# Altium schematic sheet (6) Controller A20_OUTPUT.SchDoc
size 355 x 304 mm; SheetNumber: 6; SheetTotal: 6
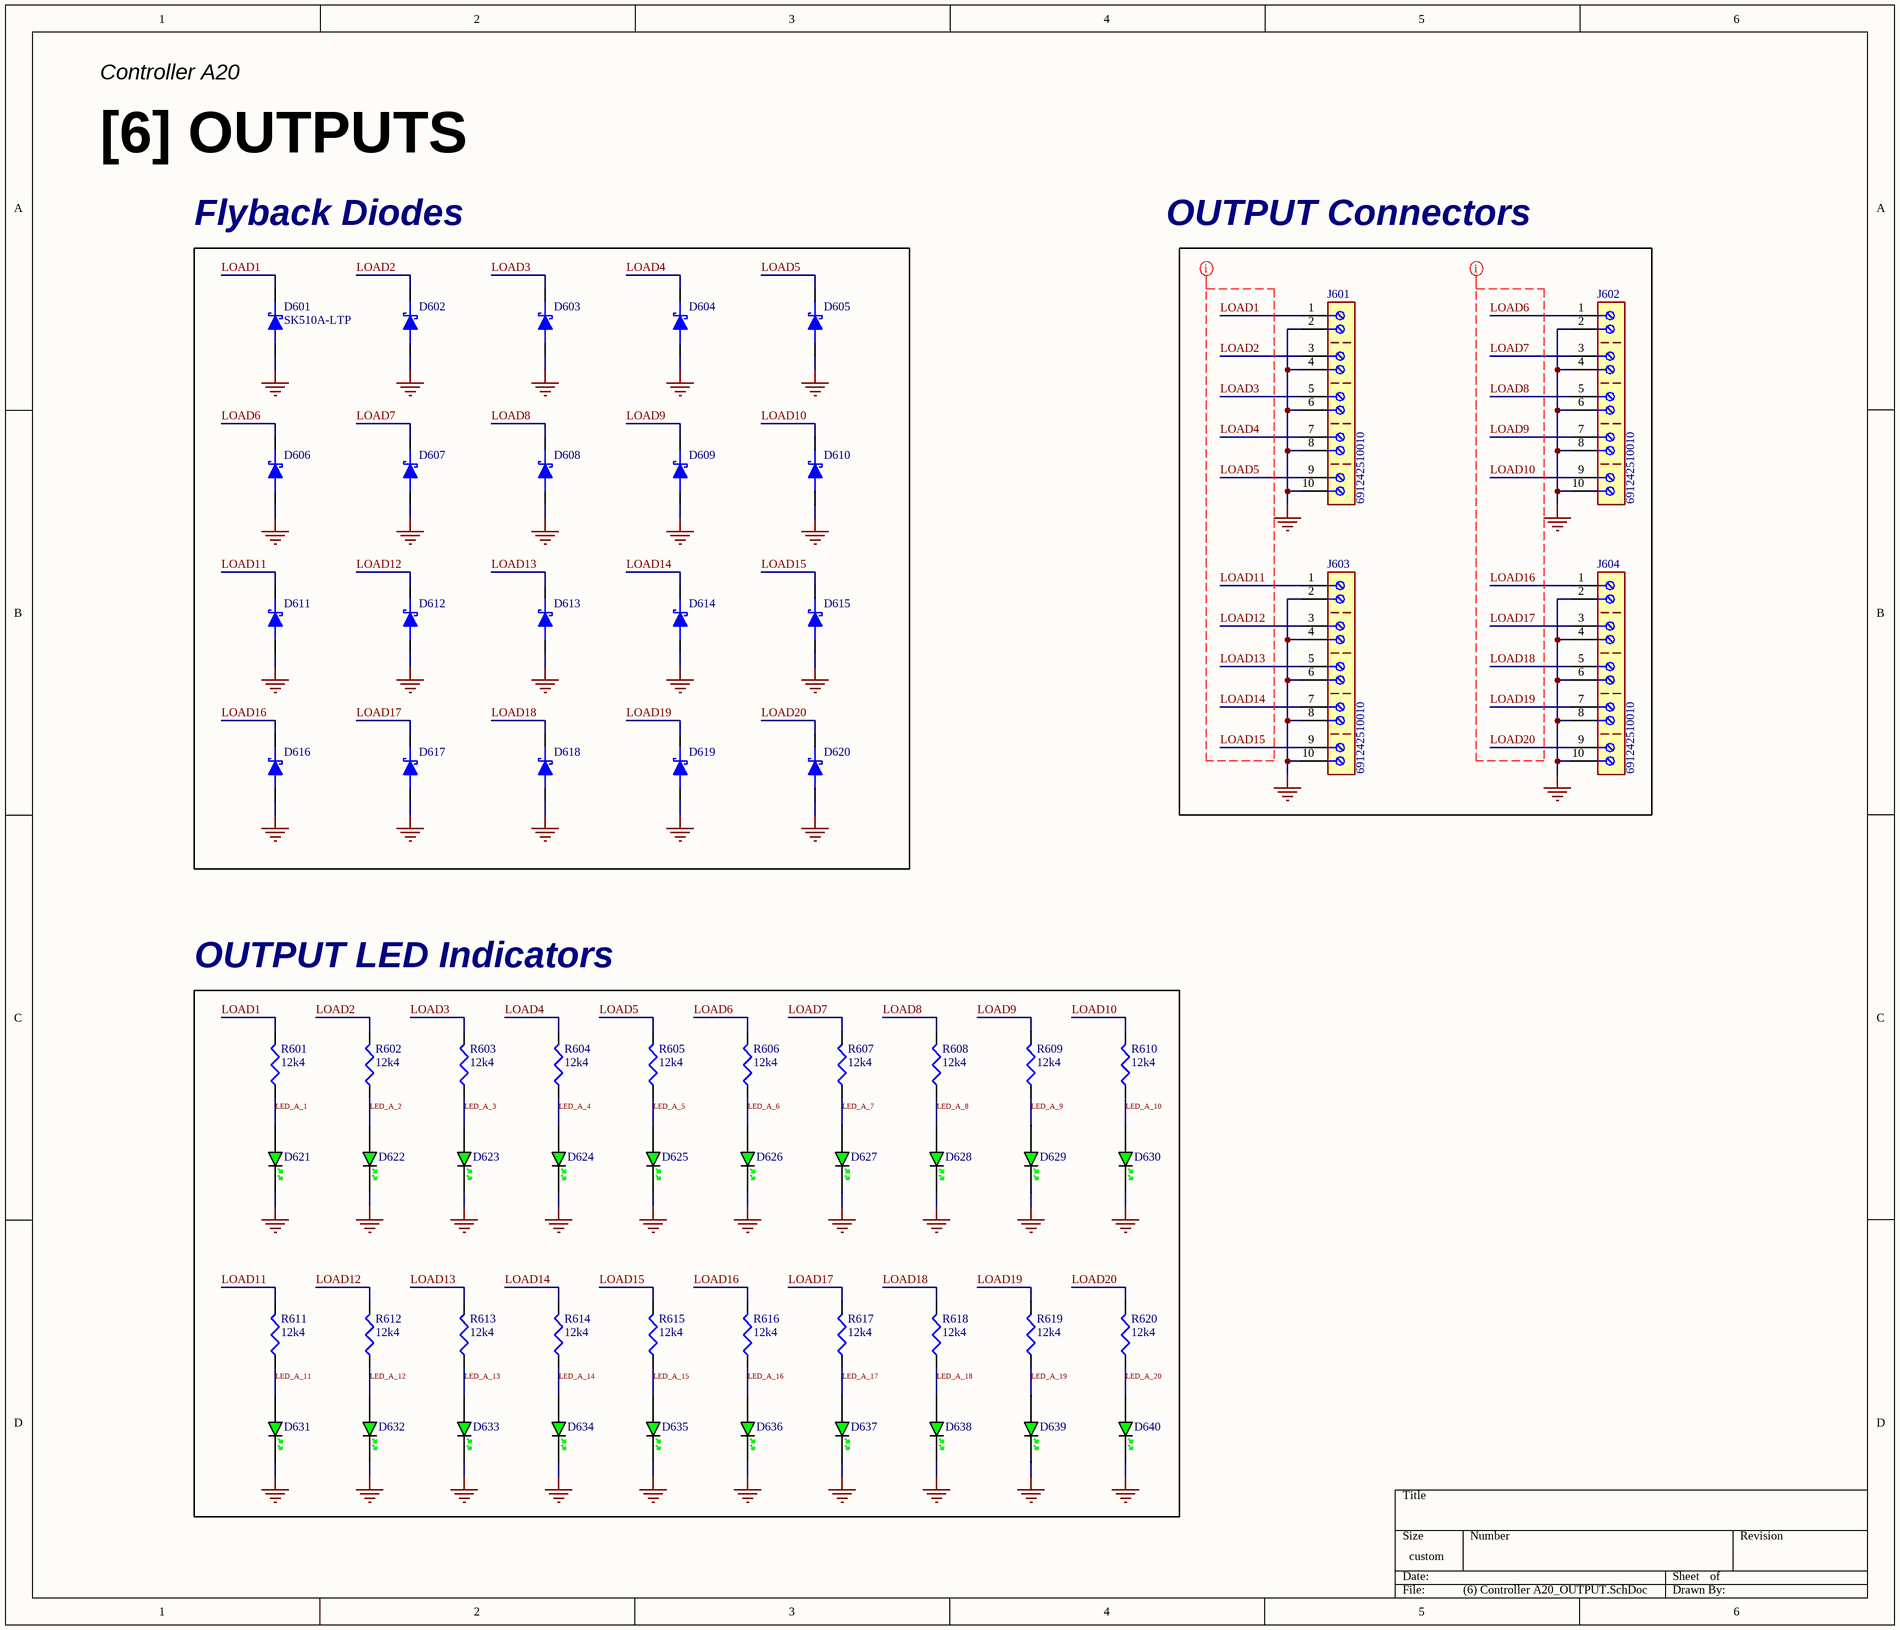
[diagram p0: (6) Controller A20_OUTPUT.SchDoc]

## Parts
D601  SK510A-LTP  [DO-214AC(SMA)]
D602  SK510A-LTP  [DO-214AC(SMA)]  (value not drawn)
D603  SK510A-LTP  [DO-214AC(SMA)]  (value not drawn)
D604  SK510A-LTP  [DO-214AC(SMA)]  (value not drawn)
D605  SK510A-LTP  [DO-214AC(SMA)]  (value not drawn)
D606  SK510A-LTP  [DO-214AC(SMA)]  (value not drawn)
D607  SK510A-LTP  [DO-214AC(SMA)]  (value not drawn)
D608  SK510A-LTP  [DO-214AC(SMA)]  (value not drawn)
D609  SK510A-LTP  [DO-214AC(SMA)]  (value not drawn)
D610  SK510A-LTP  [DO-214AC(SMA)]  (value not drawn)
D611  SK510A-LTP  [DO-214AC(SMA)]  (value not drawn)
D612  SK510A-LTP  [DO-214AC(SMA)]  (value not drawn)
D613  SK510A-LTP  [DO-214AC(SMA)]  (value not drawn)
D614  SK510A-LTP  [DO-214AC(SMA)]  (value not drawn)
D615  SK510A-LTP  [DO-214AC(SMA)]  (value not drawn)
D616  SK510A-LTP  [DO-214AC(SMA)]  (value not drawn)
D617  SK510A-LTP  [DO-214AC(SMA)]  (value not drawn)
D618  SK510A-LTP  [DO-214AC(SMA)]  (value not drawn)
D619  SK510A-LTP  [DO-214AC(SMA)]  (value not drawn)
D620  SK510A-LTP  [DO-214AC(SMA)]  (value not drawn)
D621  XL-2012UGC  [0805 G LED]  (value not drawn)
D622  XL-2012UGC  [0805 G LED]  (value not drawn)
D623  XL-2012UGC  [0805 G LED]  (value not drawn)
D624  XL-2012UGC  [0805 G LED]  (value not drawn)
D625  XL-2012UGC  [0805 G LED]  (value not drawn)
D626  XL-2012UGC  [0805 G LED]  (value not drawn)
D627  XL-2012UGC  [0805 G LED]  (value not drawn)
D628  XL-2012UGC  [0805 G LED]  (value not drawn)
D629  XL-2012UGC  [0805 G LED]  (value not drawn)
D630  XL-2012UGC  [0805 G LED]  (value not drawn)
D631  XL-2012UGC  [0805 G LED]  (value not drawn)
D632  XL-2012UGC  [0805 G LED]  (value not drawn)
D633  XL-2012UGC  [0805 G LED]  (value not drawn)
D634  XL-2012UGC  [0805 G LED]  (value not drawn)
D635  XL-2012UGC  [0805 G LED]  (value not drawn)
D636  XL-2012UGC  [0805 G LED]  (value not drawn)
D637  XL-2012UGC  [0805 G LED]  (value not drawn)
D638  XL-2012UGC  [0805 G LED]  (value not drawn)
D639  XL-2012UGC  [0805 G LED]  (value not drawn)
D640  XL-2012UGC  [0805 G LED]  (value not drawn)
J601  691242510010  [5.08mm 10P STB]
J602  691242510010  [5.08mm 10P STB]
J603  691242510010  [5.08mm 10P STB]
J604  691242510010  [5.08mm 10P STB]
R601  12k4  [R0603]
R602  12k4  [R0603]
R603  12k4  [R0603]
R604  12k4  [R0603]
R605  12k4  [R0603]
R606  12k4  [R0603]
R607  12k4  [R0603]
R608  12k4  [R0603]
R609  12k4  [R0603]
R610  12k4  [R0603]
R611  12k4  [R0603]
R612  12k4  [R0603]
R613  12k4  [R0603]
R614  12k4  [R0603]
R615  12k4  [R0603]
R616  12k4  [R0603]
R617  12k4  [R0603]
R618  12k4  [R0603]
R619  12k4  [R0603]
R620  12k4  [R0603]

## Blocks framed on the sheet
Flyback Diodes: D601-D620
OUTPUT LED Indicators: D621-D640 R601-R620

## Nets
GND: D601.1 D602.1 D603.1 D604.1 D605.1 D606.1 D607.1 D608.1 D609.1 D610.1 D611.1 D612.1 D613.1 D614.1 D615.1 D616.1 D617.1 D618.1 D619.1 D620.1 D621.2 D622.2 D623.2 D624.2 D625.2 D626.2 D627.2 D628.2 D629.2 D630.2 D631.2 D632.2 D633.2 D634.2 D635.2 D636.2 D637.2 D638.2 D639.2 D640.2 J601.2 J601.4 J601.6 J601.8 J601.10 J602.2 J602.4 J602.6 J602.8 J602.10 J603.2 J603.4 J603.6 J603.8 J603.10 J604.2 J604.4 J604.6 J604.8 J604.10
LED_A_1: D621.1 R601.1
LED_A_2: D622.1 R602.1
LED_A_3: D623.1 R603.1
LED_A_4: D624.1 R604.1
LED_A_5: D625.1 R605.1
LED_A_6: D626.1 R606.1
LED_A_7: D627.1 R607.1
LED_A_8: D628.1 R608.1
LED_A_9: D629.1 R609.1
LED_A_10: D630.1 R610.1
LED_A_11: D631.1 R611.1
LED_A_12: D632.1 R612.1
LED_A_13: D633.1 R613.1
LED_A_14: D634.1 R614.1
LED_A_15: D635.1 R615.1
LED_A_16: D636.1 R616.1
LED_A_17: D637.1 R617.1
LED_A_18: D638.1 R618.1
LED_A_19: D639.1 R619.1
LED_A_20: D640.1 R620.1
LOAD1: D601.2 J601.1 R601.2
LOAD2: D602.2 J601.3 R602.2
LOAD3: D603.2 J601.5 R603.2
LOAD4: D604.2 J601.7 R604.2
LOAD5: D605.2 J601.9 R605.2
LOAD6: D606.2 J602.1 R606.2
LOAD7: D607.2 J602.3 R607.2
LOAD8: D608.2 J602.5 R608.2
LOAD9: D609.2 J602.7 R609.2
LOAD10: D610.2 J602.9 R610.2
LOAD11: D611.2 J603.1 R611.2
LOAD12: D612.2 J603.3 R612.2
LOAD13: D613.2 J603.5 R613.2
LOAD14: D614.2 J603.7 R614.2
LOAD15: D615.2 J603.9 R615.2
LOAD16: D616.2 J604.1 R616.2
LOAD17: D617.2 J604.3 R617.2
LOAD18: D618.2 J604.5 R618.2
LOAD19: D619.2 J604.7 R619.2
LOAD20: D620.2 J604.9 R620.2

## Layout directives
net class OUTPUTs: LOAD1, LOAD2, LOAD3, LOAD4, LOAD5, LOAD6, LOAD7, LOAD8, LOAD9, LOAD10, LOAD11, LOAD12, LOAD13, LOAD14, LOAD15, LOAD16, LOAD17, LOAD18, LOAD19, LOAD20

## Notes on the sheet
- Controller A20
- [6] OUTPUTS
- OUTPUT Connectors

## Library data of the parts
D601-D620 = SK510A-LTP 100V 5A Schottky Diode: Diode 100 V 5A Surface Mount DO-214AC (SMA); Manufacturer: MCC (Micro Commercial Components); Qty.: 1; Ext. Price: 0.5; Mfr. Part #: SK510A-LTP; Supplier: DigiKey; Supplier Part #: SK510A-LTPMSCT-ND; Package: DO-214AC(SMA); Unit Price: 0.5; ComponentLink1Description: Datasheet; ComponentLink1URL: https://www.mccsemi.com/pdf/Products/SK52A-L_SK5200A-L(SMA).pdf; ComponentLink2Description: Distributor Link; ComponentLink2URL: https://www.digikey.com/en/products/detail/mcc-micro-commercial-components/SK510A-LTP/5114130
D621-D640 = LED EMERALD: Green 525nm LED Indication - Discrete 2.9V 0805 (2012 Metric); Manufacturer: XINGLIGHT; Qty.: 3000; Ext. Price: 33.75; Mfr. Part #: XL-2012UGC; Supplier: DigiKey; Supplier Part #: 5962-XL-2012UGCTR-ND; Package: 0805; Unit Price: 0.01125; ComponentLink1Description: Datasheet; ComponentLink1URL: https://mm.digikey.com/Volume0/opasdata/d220001/medias/docus/6472/5962_XL-2012UGC%200805%E7%BF%A0%E7%BB%BF.pdf; ComponentLink2Description: Distributor Link; ComponentLink2URL: https://www.digikey.com/en/products/detail/xinglight/XL-2012UGC/25673312
J601-J604 = Terminal Block 10P 14A: 10 Position Wire to Board Terminal Block Horizontal with Board 0.200" (5.08mm) Through Hole; Manufacturer: Würth Elektronik; Qty.: 1; Ext. Price: 5.17; Mfr. Part #: 691242510010; Supplier: DigiKey; Supplier Part #: 732-691242510010-ND; Package: Through Hole, P=5.08mm; Unit Price: 5.17; ComponentLink1Description: Datasheet; ComponentLink1URL: https://www.we-online.com/components/products/datasheet/691242510010.pdf; ComponentLink2Description: Distributor Link; ComponentLink2URL: https://www.digikey.com/en/products/detail/w%C3%BCrth-elektronik/691242510010/11477533?s=N4IgTCBcDaIGwE4CMYAsYCsSAM2cgF0BfIA
R601-R620 = RES 12.4k: 12.4 kOhms ±1% 0.1W, 1/10W Chip Resistor 0603 (1608 Metric) Moisture Resistant Thick Film; Manufacturer: YAGEO; Mfr. Part #: RC0603FR-0712K4L; Qty.: 10; Ext. Price: 0.07; Supplier: DigiKey; Supplier Part #: 311-12.4KHRCT-ND; Package: 0603; Unit Price: 0.007; ComponentLink1Description: Datasheet; ComponentLink1URL: https://www.yageogroup.com/content/datasheet/asset/file/PYU-RT_1-TO-0-01_ROHS_L; ComponentLink2Description: Distributor Link; ComponentLink2URL: https://www.digikey.com/en/products/detail/yageo/RC0603FR-0712K4L/726917